# Altium schematic sheet PMOD-T3-T6.SchDoc: Expansipon PMOD type 3 et 6
size Letter; ApprovedBy: k.cotton; Engineer: K.Cotton; Organization: Cegep Limoilou; Address1: 1300, 8e Avenue; Address2: Québec, QC; Address3: Canada; Address4: G1J 5L5; SheetNumber: 5; SheetTotal: 5
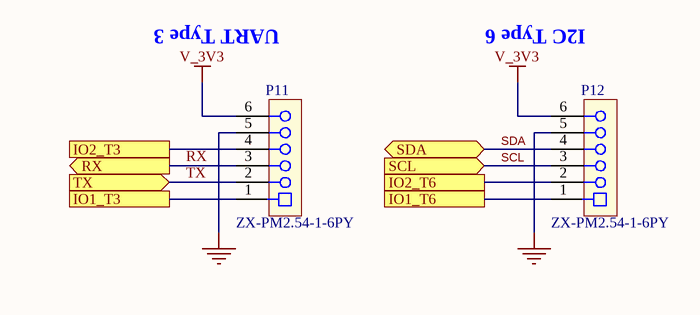
[diagram p0: PMOD-T3-T6.SchDoc]

## Parts
P11  ZX-PM2.54-1-6PY  [CONN_SKT_01X06_100MIL]
P12  ZX-PM2.54-1-6PY  [CONN_SKT_01X06_100MIL]

## Ports
IO1_T3 (see 243-5xx_Pi-CAN-PWM[2C]), IO1_T6 (see 243-5xx_Pi-CAN-PWM[2C]), IO2_T3 (see 243-5xx_Pi-CAN-PWM[2C]), IO2_T6 (see 243-5xx_Pi-CAN-PWM[2C]), RX (out, see 243-5xx_Pi-CAN-PWM[2C], Pi5-Interface[2B]), SCL (in, see 243-5xx_Pi-CAN-PWM[2C], Ctrl-PWM[1B], Pi5-Interface[1B]), SDA (bidir, see 243-5xx_Pi-CAN-PWM[2C], Ctrl-PWM[1B], Pi5-Interface[1B]), TX (in, see 243-5xx_Pi-CAN-PWM[2C], Pi5-Interface[2B])

## Nets
GND: P11.5 P12.5
V_3V3: P11.6 P12.6
IO1_T3: P11.1 ; port IO1_T3
IO1_T6: P12.1 ; port IO1_T6
IO2_T3: P11.4 ; port IO2_T3
IO2_T6: P12.2 ; port IO2_T6
RX: P11.3 ; port RX
SCL: P12.3 ; port SCL
SDA: P12.4 ; port SDA
TX: P11.2 ; port TX

## Notes on the sheet
- UART Type 3
- I2C Type 6
- Titre :
- Conception :
- Date :
- Approbation :
- Heure :
- Révision :
- Feuille
- de
- Fichier :

## Library data of the parts
P11 P12 = CONN-100MIL-SKT-01X06: CONN SOCKET 6pos 100mils; Manufacturer 1: Megastar; Mounting Technology: TH; Manufacturer Part Number 1: ZX-PM2.54-1-6PY; Supplier 1: LCSC; Supplier Part Number 1: C7499326